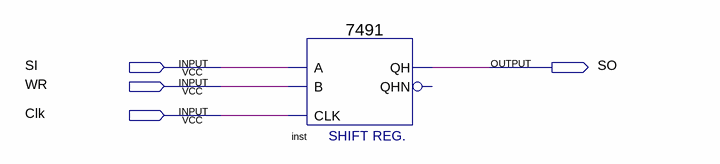
[diagram p0: schematic sheet]
// Quartus schematic 8-bits_SISO_Register.bdf as structural Verilog: 1 symbols, 4 pins
module \8-bits_SISO_Register  (
  input  SI,
  input  WR,
  input  Clk,
  output SO
);

  \7491  inst (.A(SI), .B(WR), .CLK(Clk), .QH(SO));  // open: QHN
endmodule
